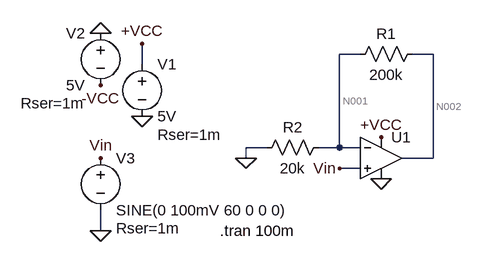
[diagram p0: schematic OpAmpNInversor.asc]
OpAmpNInversor.asc, the LTspice schematic file:
Version 4
SHEET 1 880 680
WIRE -176 -112 -208 -112
WIRE -64 -112 -96 -112
WIRE -512 -96 -512 -128
WIRE -320 32 -352 32
WIRE -208 32 -208 -112
WIRE -208 32 -240 32
WIRE -176 32 -208 32
WIRE -352 48 -352 32
WIRE -64 48 -64 -112
WIRE -64 48 -112 48
WIRE -176 64 -208 64
WIRE -576 160 -576 128
FLAG -512 -128 +VCC
FLAG -576 -64 -VCC
FLAG -512 -16 0
FLAG -144 16 +VCC
FLAG -576 160 0
FLAG -576 48 Vin
FLAG -208 64 Vin
FLAG -352 48 0
FLAG -144 80 0
FLAG -576 -144 0
SYMBOL Opamps\\UniversalOpamp2 -144 48 R0
SYMATTR InstName U1
SYMBOL voltage -512 -112 R0
WINDOW 123 0 0 Left 2
WINDOW 39 24 124 Left 2
SYMATTR SpiceLine Rser=1m
SYMATTR InstName V1
SYMATTR Value 5V
SYMBOL voltage -576 -160 M0
WINDOW 123 0 0 Left 2
WINDOW 39 24 124 Left 2
SYMATTR SpiceLine Rser=1m
SYMATTR InstName V2
SYMATTR Value 5V
SYMBOL res -192 -96 R270
WINDOW 0 32 56 VTop 2
WINDOW 3 0 56 VBottom 2
SYMATTR InstName R1
SYMATTR Value 200k
SYMBOL res -336 48 R270
WINDOW 0 32 56 VTop 2
WINDOW 3 0 56 VBottom 2
SYMATTR InstName R2
SYMATTR Value 20k
SYMBOL voltage -576 32 R0
WINDOW 123 0 0 Left 2
WINDOW 39 24 124 Left 2
SYMATTR SpiceLine Rser=1m
SYMATTR InstName V3
SYMATTR Value SINE(0 100mV 60 0 0 0)
TEXT -392 160 Left 2 !.tran 100m

The netlist it stands for:
* OpAmpNInversor.asc
XU1 Vin N001 +VCC 0 N002 level.2 Avol=1Meg GBW=10Meg Slew=10Meg ilimit=25m rail=0 Vos=0 phimargin=45 en=0 enk=0 in=0 ink=0 Rin=500Meg  ; pins IN+ IN- V+ V- OUT
V1 +VCC 0 5V Rser=1m
V2 0 -VCC 5V Rser=1m
R1 N001 N002 200k
R2 0 N001 20k
V3 Vin 0 SINE(0 100mV 60 0 0 0) Rser=1m
.tran 100m
.lib UniversalOpamps2.sub
.backanno
.end

* Results of the author's LTspice run, read from the files saved beside the schematic
* Operating Point, zero values left out:
*   V(n002) = 18.44 mV
*   V(+vcc) = 5 V
*   V(n001) = 1.767 mV
*   V(-vcc) = -5 V
*   I(R2) = -88.36 nA
*   I(R1) = -83.37 nA
*   I(V3) = 5 nA
*   I(V1) = -30.39 µA
*   Ix(u1:1) = -5 nA
*   Ix(u1:2) = -4.996 nA
*   Ix(u1:3) = 30.39 µA
*   Ix(u1:4) = -30.27 µA
*   Ix(u1:5) = -83.37 nA
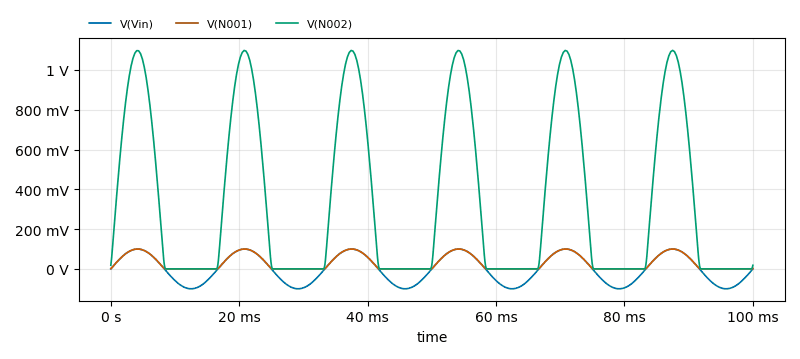
[diagram p1: Transient Analysis of OpAmpNInversor.asc, plotted from the saved traces]
* Transient Analysis, 1 run:
*   V(Vin): min -99.96 mV, max 99.97 mV, average -475.7 nV, rms 70.66 mV, last 0 V
*   V(N001): min 91.53 µV, max 99.97 mV, average 31.87 mV, rms 49.97 mV, last 1.762 mV
*   V(N002): min 6.86 µV, max 1.099 V, average 349.6 mV, rms 549 mV, last 18.38 mV